# Altium schematic sheet Sheet1.SchDoc
size A4; SheetNumber: 1; SheetTotal: 1
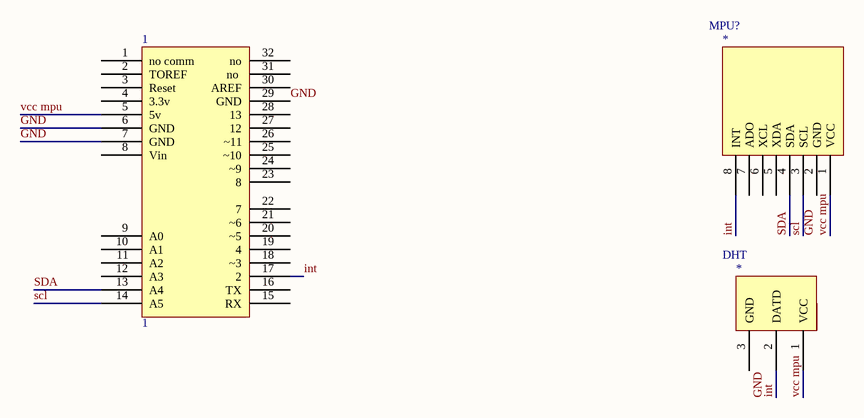
[diagram p0: Sheet1.SchDoc]

## Parts
(Parts that share a designator on the sheet are numbered #1, #2 ... from top to bottom, then left to right.)
1  1  [Arduino ieee]
*#1  MPU?  [MPU]
*#2  DHT  [DHT - duplicate]

## Nets
GND: 1.6(GND) 1.7(GND) 1.29(GND) *#2.3(GND)
int: 1.17(2) *#1.8(INT) *#2.2(DATD)
scl: 1.14(A5) *#1.3(SCL)
SDA: 1.13(A4) *#1.4(SDA)
vcc mpu: 1.5(5v) *#1.1(VCC) *#2.1(VCC)

Not connected (* = marked no-connect by the designer): 1 1(no_comm) 2(TOREF) 3(Reset) 4(3.3v) 8(Vin) 9(A0) 10(A1) 11(A2) 12(A3) 15(RX) 16(TX) 18(~3) 19(4) 20(~5) 21(~6) 22(7) 23(8) 24(~9) 25(~10) 26(~11) 27(12) 28(13) 30(AREF) 31(no_) 32(no); *#1 2(GND) 5(XDA) 6(XCL) 7(ADO)

## Notes on the sheet
- Labels drawn without touching a wire or pin: GND

## Library data of the parts
1 = ARDUINO?: Parameter 1: ARDUINO
*#1 = MPU?: Parameter 1: mpu
*#2 = DHT: Parameter 1: DHT